# EAGLE design 1pcb (EAGLE 7.2.0)
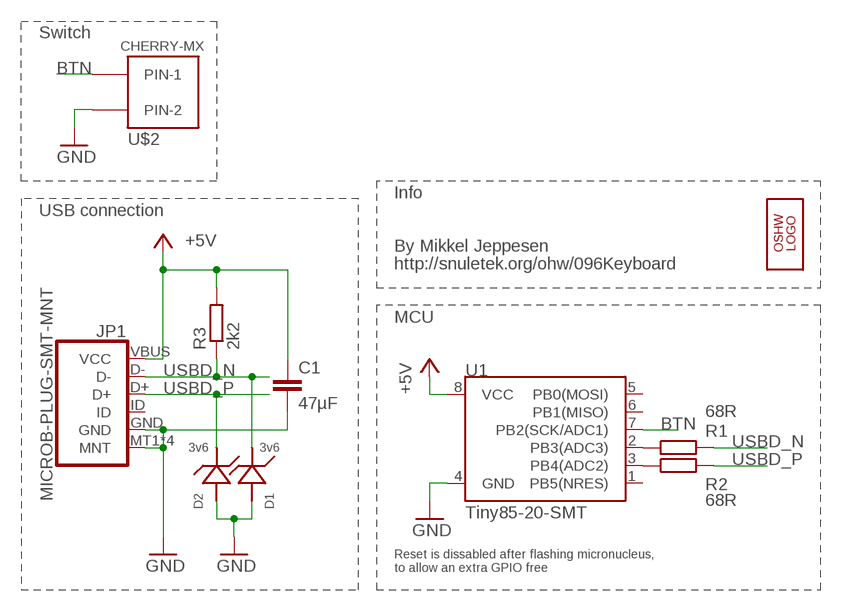
[diagram p0: schematic, sheet 1]

## Parts
C1  47µF  C-EUC3216  [C3216]
D1  3v6  ZENER-DIODE  [SOD-523]
D2  3v6  ZENER-DIODE  [SOD-523]
JP1  MICROB-PLUG-SMT-MNT  [USB-MICROB]
LOGO1  OSHW_LOGO_6MILX0070-NT  [OSHW_6X70_NOTEXT]
R1  68R  R-EU_R0603  [R0603]
R2  68R  R-EU_R0603  [R0603]
R3  2k2  R-EU_R0603  [R0603]
U1  Tiny85-20-SMT  ATTINY45TINY85-20-SMT  [SO08-EIAJ]
U$2  CHERRY-MX-I  [CHERRY-MX-I]

## Nets
+5V: C1.1 JP1.VBUS(VCC) R3.2 U1.8(VCC)
BTN: U1.7(PB2(SCK/ADC1)) U$2.PIN-1
GND: C1.2 D1.A D2.A JP1.GND JP1.MT1(MNT) JP1.MT2(MNT) JP1.P$1(MNT) JP1.P$2(MNT) U1.4(GND) U$2.PIN-2
N$1: R1.1 U1.2(PB3(ADC3))
N$2: R2.1 U1.3(PB4(ADC2))
USBD_N: D1.C JP1.D- R1.2 R3.1
USBD_P: D2.C JP1.D+ R2.2
Unconnected: JP1.ID U1.1(PB5(NRES)) U1.5(PB0(MOSI)) U1.6(PB1(MISO))

## Notes on the sheet
- Switch
- Info
- USB connection
- By Mikkel Jeppesen
- http://snuletek.org/ohw/096Keyboard
- MCU
- Reset is dissabled after flashing micronucleus,
  to allow an extra GPIO free

## Library data of the parts
C1 = resistor:C-EU: CAPACITOR, European symbol
D1 D2 = Custom-parts:ZENER-DIODE
JP1 = SparkFun-Connectors:MICROB-PLUG-SMT-MNT
LOGO1 = ohw-logo:OSHW_LOGO_6MIL
R1-R3 = resistor:R-EU_: RESISTOR, European symbol
U1 = SparkFun-DigitalIC:ATTINY45: Atmel 8-pin 2/4/8kB flash uC; PROD_ID: IC-09092
U$2 = cherrymx:CHERRY-MX-I

## Board
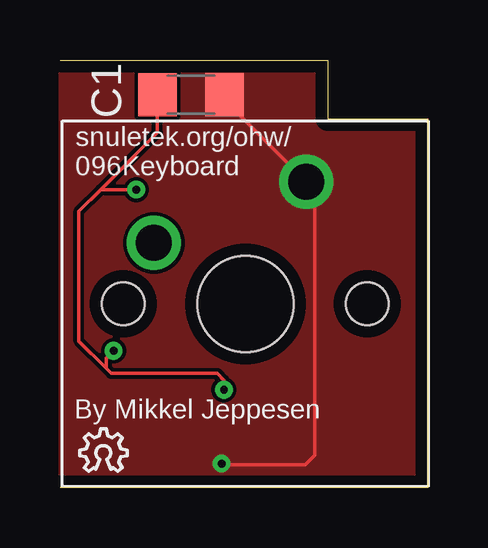
[diagram p1: board, top side]
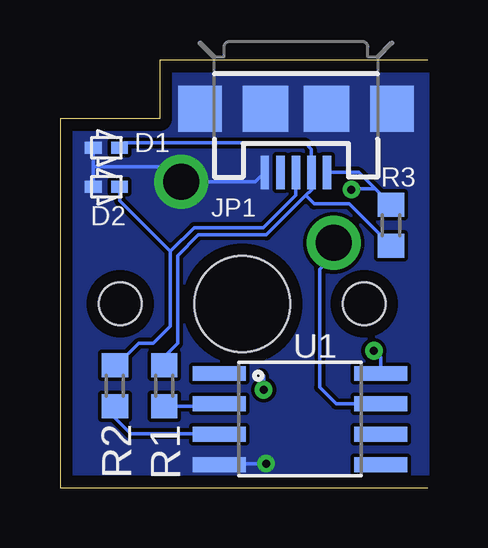
[diagram p2: board, bottom side, seen from below]

Size 15.32 x 17.83 mm. Coordinates in mm from the lower left corner, seen from the top.
Outline: 0,17.83 11.15,17.83 11.15,15.39 15.32,15.39 15.32,0 0,0
Copper layers (1*16): Top 0.035mm / dielectric 1.5mm / Bottom 0.035mm
Design rules "OSH park": minimum track width 6mil, minimum drill 13mil, track to track 6mil, track to pad 6mil, pad to pad 6mil, via to via 6mil, smd to smd 6mil, copper to edge 20mil, drill to drill 16mil, minimum pad ring 10mil, minimum via ring 8mil, stop-mask expansion 4mil, vias tented up to drill 0mil, thermal gap 16mil

### Footprints (pad centres in the part's own frame; a part is rotated, then mirrored left to right if it is on the bottom)
C3216 = smd 1.6 x 1.8: 1 -1.4,0; 2 1.4,0
SOD-523 = smd 0.7 x 0.5: A -0.55,0; C 0.55,0
USB-MICROB = smd 0.35 x 1.4: D+ 0,2.65; D- -0.65,2.65; GND 1.3,2.65; ID 0.65,2.65; VBUS -1.3,2.65 | smd 1.8 x 1.9: MT1 -4,0; MT2 4,0 | smd 1.9 x 1.9: P$1 -1.27,0; P$2 1.27,0
R0603 = smd 1 x 1.1: 1 -0.85,0; 2 0.85,0
SO08-EIAJ = smd 0.61 x 2.21: 1 -1.905,-3.378; 2 -0.635,-3.378; 3 0.635,-3.378; 4 1.905,-3.378; 5 1.905,3.353; 6 0.635,3.353; 7 -0.635,3.353; 8 -1.905,3.353
CHERRY-MX-I = drill 1.5 pad 2.184: PIN-1 -3.81,2.54; PIN-2 2.54,5.08 | hole 4: 0,0 | hole 1.778: -5.08,0; 5.08,0

### Placement (x,y rotation side)
C1  5.46,16.38 0 top
D1  13.39,14.17 0 bottom
D2  13.39,12.55 0 bottom
JP1  5.49,15.8 180 bottom
LOGO1  0.81,0.69 0 top
R1  10.97,4.25 90 bottom
R2  13.03,4.25 90 bottom
R3  1.52,10.95 90 bottom
U1  5.31,2.87 270 bottom
U$2  7.72,7.67 0 top

### Tracks (layer width: path | path; a pad name or v marks a point on that pad's centre or on a via)
+5V  (via drill 0.33)
  Top 0.152: 1.69,12.43 0.79,11.53 0.79,6.12 1.92,4.99 | 1.69,12.43 4.06,14.8 C1.1 | 1.69,12.43 v3.17,12.43 | 1.92,4.99 2.13,4.77 6.55,4.77 6.83,4.5 v6.83,4.09 | v2.23,5.71 1.92,5.4 1.92,4.99
  Bottom 0.152: R3.2 2.19,12.46 | 2.19,12.46 2.88,13.15 JP1.VBUS | v3.17,12.43 3.14,12.46 2.19,12.46 | v6.83,4.09 6.83,4.67 6.93,4.77 | U1.8 1.96,5.44 v2.23,5.71
BTN
  Bottom 0.152: U$2.PIN-1 3.91,9.7 4.5,9.12 4.5,4.19 3.81,3.5 U1.7
GND  (via drill 0.33)
  Top 0.152: C1.2 6.86,16.15 U$2.PIN-2 10.62,12.39 10.62,1.37 10.21,0.96 6.78,0.96 v6.73,1.02
  Bottom 0.152: 10.22,12.79 U$2.PIN-2 | JP1.GND 7.18,12.75 U$2.PIN-2 | v6.73,1.02 8.64,1.02 U1.4 | D1.A D2.A 13.94,13.39 10.9,13.39 U$2.PIN-2
  pour Bottom (no thermals): 0,17.83 11.43,17.83 11.43,15.61 15.56,15.61 15.56,0.05 0,0.05
  pour Top (no thermals): 0,17.83 11.43,17.83 11.43,15.61 15.56,15.61 15.56,0.05 0,0.05
N$1
  Bottom 0.152: U1.2 8.79,3.4 R1.1
N$2
  Bottom 0.152: U1.3 8.71,2.26 12.37,2.26 13.03,2.92 R2.1
USBD_N
  Bottom 0.152: R3.1 3.26,11.84 4.72,11.84 5.07,12.19 | 5.07,12.19 4.84,12.42 JP1.D- 4.85,13.16 4.85,14.12 5.11,14.38 12.63,14.38 D1.C | 5.07,12.19 6.72,10.54 9.55,10.54 10.41,9.68 10.41,6.02 10.95,5.49 10.95,5.13 R1.2
USBD_P
  Bottom 0.152: JP1.D+ 5.49,12.2 6.84,10.85 9.73,10.85 10.72,9.85 | 10.72,9.85 10.72,6.73 11.43,6.02 12.04,6.02 12.96,5.1 R2.2 | D2.C 12.84,11.97 10.72,9.85

### Text on the board
tPlace: snuletek.org/ohw/ | 096Keyboard | By Mikkel Jeppesen